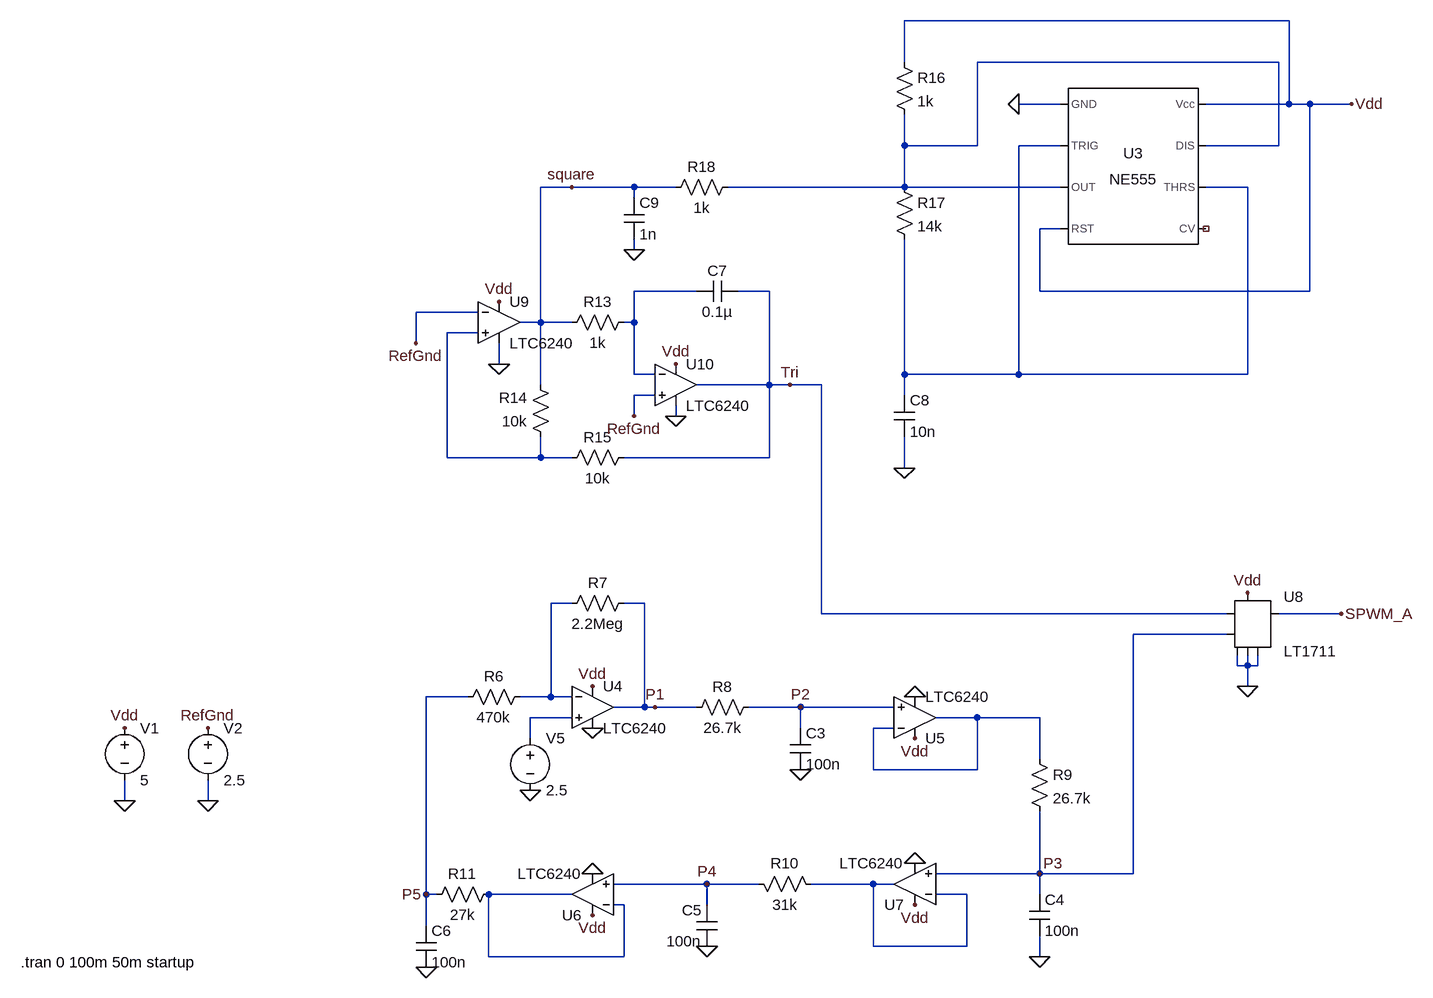
[diagram p0: schematic Tri and Sine Generators.asc]
Tri and Sine Generators.asc, the LTspice schematic file:
Version 4.1
SHEET 1 1288 1076
WIRE 896 -400 304 -400
WIRE 304 -336 304 -400
WIRE 880 -336 416 -336
WIRE 544 -272 480 -272
WIRE 896 -272 896 -400
WIRE 896 -272 768 -272
WIRE 928 -272 896 -272
WIRE 992 -272 928 -272
WIRE 304 -208 304 -256
WIRE 416 -208 416 -336
WIRE 416 -208 304 -208
WIRE 544 -208 480 -208
WIRE 880 -208 880 -336
WIRE 880 -208 768 -208
WIRE -208 -144 -256 -144
WIRE -112 -144 -208 -144
WIRE -48 -144 -112 -144
WIRE 304 -144 304 -208
WIRE 304 -144 32 -144
WIRE 544 -144 304 -144
WIRE 832 -144 768 -144
WIRE -112 -128 -112 -144
WIRE 544 -80 512 -80
WIRE -112 -48 -112 -64
WIRE -16 16 -112 16
WIRE 96 16 48 16
WIRE 512 16 512 -80
WIRE 928 16 928 -272
WIRE 928 16 512 16
WIRE -352 48 -448 48
WIRE -256 64 -256 -144
WIRE -256 64 -288 64
WIRE -208 64 -256 64
WIRE -112 64 -112 16
WIRE -112 64 -128 64
WIRE -352 80 -400 80
WIRE -448 96 -448 48
WIRE -320 128 -320 96
WIRE -112 144 -112 64
WIRE -80 144 -112 144
WIRE 304 144 304 -64
WIRE 480 144 480 -208
WIRE 480 144 304 144
WIRE 832 144 832 -144
WIRE 832 144 480 144
WIRE -256 160 -256 64
WIRE 96 160 96 16
WIRE 96 160 -16 160
WIRE 128 160 96 160
WIRE 176 160 128 160
WIRE -80 176 -112 176
WIRE 304 176 304 144
WIRE -112 208 -112 176
WIRE -48 208 -48 192
WIRE -400 272 -400 80
WIRE -256 272 -256 240
WIRE -256 272 -400 272
WIRE -208 272 -256 272
WIRE 96 272 96 160
WIRE 96 272 -128 272
WIRE 304 288 304 240
WIRE -208 496 -240 496
WIRE -96 496 -128 496
WIRE 176 512 176 160
WIRE 800 512 176 512
WIRE 976 512 880 512
WIRE 800 544 656 544
WIRE 816 592 816 576
WIRE 832 592 832 576
WIRE 832 592 816 592
WIRE 848 592 848 576
WIRE 848 592 832 592
WIRE 832 624 832 592
WIRE -368 640 -432 640
WIRE -240 640 -240 496
WIRE -240 640 -288 640
WIRE -208 640 -240 640
WIRE -96 656 -96 496
WIRE -96 656 -144 656
WIRE -80 656 -96 656
WIRE -16 656 -80 656
WIRE 144 656 64 656
WIRE 288 656 144 656
WIRE -208 672 -272 672
WIRE 416 672 352 672
WIRE 512 672 416 672
WIRE 144 688 144 656
WIRE 288 688 256 688
WIRE -272 704 -272 672
WIRE 512 736 512 672
WIRE 256 752 256 688
WIRE 416 752 416 672
WIRE 416 752 256 752
WIRE -896 800 -896 768
WIRE -768 800 -768 768
WIRE 512 912 512 816
WIRE 512 912 352 912
WIRE 656 912 656 544
WIRE 656 912 512 912
WIRE 0 928 -144 928
WIRE 80 928 0 928
WIRE 256 928 160 928
WIRE 288 928 256 928
WIRE -432 944 -432 640
WIRE -416 944 -432 944
WIRE -208 944 -336 944
WIRE 400 944 352 944
WIRE 512 944 512 912
WIRE -128 960 -144 960
WIRE 0 960 0 928
WIRE -432 992 -432 944
WIRE 256 1024 256 928
WIRE 400 1024 400 944
WIRE 400 1024 256 1024
WIRE -336 1040 -336 944
WIRE -128 1040 -128 960
WIRE -128 1040 -336 1040
WIRE 512 1040 512 1008
FLAG -896 800 0
FLAG -896 688 Vdd
FLAG -768 800 0
FLAG -768 688 RefGnd
FLAG -80 656 P1
FLAG 144 752 0
FLAG -176 688 0
FLAG 512 1040 0
FLAG 0 1024 0
FLAG -432 1056 0
FLAG 144 656 P2
FLAG 512 912 P3
FLAG 0 928 P4
FLAG -432 944 P5
FLAG -176 624 Vdd
FLAG 320 704 Vdd
FLAG 320 960 Vdd
FLAG -176 976 Vdd
FLAG -272 784 0
FLAG 320 640 0
FLAG 320 896 0
FLAG -176 912 0
FLAG 976 512 SPWM_A
FLAG 832 480 Vdd
FLAG 832 624 0
FLAG -320 32 Vdd
FLAG -48 128 Vdd
FLAG -320 128 0
FLAG -48 208 0
FLAG -448 96 RefGnd
FLAG -112 208 RefGnd
FLAG 304 288 0
FLAG 480 -272 0
FLAG 128 160 Tri
FLAG -112 -48 0
FLAG 992 -272 Vdd
FLAG -208 -144 square
SYMBOL voltage -896 672 R0
SYMATTR InstName V1
SYMATTR Value 5
SYMBOL voltage -768 672 R0
WINDOW 123 0 0 Left 0
WINDOW 39 0 0 Left 0
SYMATTR InstName V2
SYMATTR Value 2.5
SYMBOL res -272 624 R90
WINDOW 0 0 56 VBottom 2
WINDOW 3 32 56 VTop 2
SYMATTR InstName R6
SYMATTR Value 470k
SYMBOL res -112 480 R90
WINDOW 0 0 56 VBottom 2
WINDOW 3 32 56 VTop 2
SYMATTR InstName R7
SYMATTR Value 2.2Meg
SYMBOL res 80 640 R90
WINDOW 0 0 56 VBottom 2
WINDOW 3 32 56 VTop 2
SYMATTR InstName R8
SYMATTR Value 26.7k
SYMBOL cap 128 688 R0
SYMATTR InstName C3
SYMATTR Value 100n
SYMBOL res 496 720 R0
SYMATTR InstName R9
SYMATTR Value 26.7k
SYMBOL cap 496 944 R0
SYMATTR InstName C4
SYMATTR Value 100n
SYMBOL res 64 912 M90
WINDOW 0 0 56 VBottom 2
WINDOW 3 32 56 VTop 2
SYMATTR InstName R10
SYMATTR Value 31k
SYMBOL cap 16 960 M0
SYMATTR InstName C5
SYMATTR Value 100n
SYMBOL res -320 928 R90
WINDOW 0 0 56 VBottom 2
WINDOW 3 32 56 VTop 2
SYMATTR InstName R11
SYMATTR Value 27k
SYMBOL cap -448 992 R0
SYMATTR InstName C6
SYMATTR Value 100n
SYMBOL voltage -272 688 R0
WINDOW 123 0 0 Left 0
WINDOW 39 0 0 Left 0
SYMATTR InstName V5
SYMATTR Value 2.5
SYMBOL lib\\sym\\ZZZ\\OpAmps\\LTC6240 -176 656 R0
SYMATTR InstName U4
SYMBOL lib\\sym\\ZZZ\\OpAmps\\LTC6240 320 672 M180
SYMATTR InstName U5
SYMBOL lib\\sym\\ZZZ\\OpAmps\\LTC6240 -176 944 R180
SYMATTR InstName U6
SYMBOL lib\\sym\\ZZZ\\OpAmps\\LTC6240 320 928 R180
SYMATTR InstName U7
SYMBOL Comparators\\LT1711 832 528 R0
SYMATTR InstName U8
SYMBOL res -112 48 R90
WINDOW 0 0 56 VBottom 2
WINDOW 3 32 56 VTop 2
SYMATTR InstName R13
SYMATTR Value 1k
SYMBOL res -240 256 R180
WINDOW 0 36 76 Left 2
WINDOW 3 36 40 Left 2
SYMATTR InstName R14
SYMATTR Value 10k
SYMBOL res -224 288 R270
WINDOW 0 32 56 VTop 2
WINDOW 3 0 56 VBottom 2
SYMATTR InstName R15
SYMATTR Value 10k
SYMBOL cap 48 0 R90
WINDOW 0 0 32 VBottom 2
WINDOW 3 32 32 VTop 2
SYMATTR InstName C7
SYMATTR Value 0.1µ
SYMBOL Misc/NE555 656 -176 R0
SYMATTR InstName U3
SYMBOL Res 288 -352 R0
SYMATTR InstName R16
SYMATTR Value 1k
SYMBOL Cap 288 176 R0
SYMATTR InstName C8
SYMATTR Value 10n
SYMBOL Res 288 -160 R0
SYMATTR InstName R17
SYMATTR Value 14k
SYMBOL lib\\sym\\ZZZ\\OpAmps\\LTC6240 -320 64 R0
SYMATTR InstName U9
SYMBOL lib\\sym\\ZZZ\\OpAmps\\LTC6240 -48 160 R0
SYMATTR InstName U10
SYMBOL res 48 -160 R90
WINDOW 0 0 56 VBottom 2
WINDOW 3 32 56 VTop 2
SYMATTR InstName R18
SYMATTR Value 1k
SYMBOL cap -128 -128 R0
SYMATTR InstName C9
SYMATTR Value 1n
TEXT -1056 1048 Left 2 !.tran 0 100m 50m startup

The netlist it stands for:
* Tri and Sine Generators.asc
V1 Vdd 0 5
V2 RefGnd 0 2.5
R6 N005 P5 470k
R7 P1 N005 2.2Meg
R8 P2 P1 26.7k
C3 P2 0 100n
R9 N007 P3 26.7k
C4 P3 0 100n
R10 P4 N008 31k
C5 P4 0 100n
R11 N009 P5 27k
C6 P5 0 100n
V5 N006 0 2.5
* U4: LTC6240 (symbol lib\sym\ZZZ\OpAmps\LTC6240 not available, pins judged from their places): In+=N006 In-=N005 V+=Vdd V-=0 OUT=P1
* U5: LTC6240 (symbol lib\sym\ZZZ\OpAmps\LTC6240 not available, pins judged from their places): In+=P2 In-=N007 V+=Vdd V-=0 OUT=N007
* U6: LTC6240 (symbol lib\sym\ZZZ\OpAmps\LTC6240 not available, pins judged from their places): In+=P4 In-=N009 V+=Vdd V-=0 OUT=N009
* U7: LTC6240 (symbol lib\sym\ZZZ\OpAmps\LTC6240 not available, pins judged from their places): In+=P3 In-=N008 V+=Vdd V-=0 OUT=N008
X§U8 P3 Tri Vdd 0 0 SPWM_A NC_01 0 LT1711
R13 N003 square 1k
R14 N004 square 10k
R15 N004 Tri 10k
C7 Tri N003 0.1µ
X§U3 0 N002 N001 Vdd NC_02 N002 N001 Vdd NE555  ; pins GND TRIG OUT RST CV THRS DIS Vcc
R16 Vdd N001 1k
C8 N002 0 10n
R17 N001 N002 14k
* U9: LTC6240 (symbol lib\sym\ZZZ\OpAmps\LTC6240 not available, pins judged from their places): In+=N004 In-=RefGnd V+=Vdd V-=0 OUT=square
* U10: LTC6240 (symbol lib\sym\ZZZ\OpAmps\LTC6240 not available, pins judged from their places): In+=RefGnd In-=N003 V+=Vdd V-=0 OUT=Tri
R18 N001 square 1k
C9 square 0 1n
.tran 0 100m 50m startup
.lib NE555.sub
.backanno
.end